# Altium schematic sheet OZ440-SE100-CAR003_sheet8.SchDoc
size A3
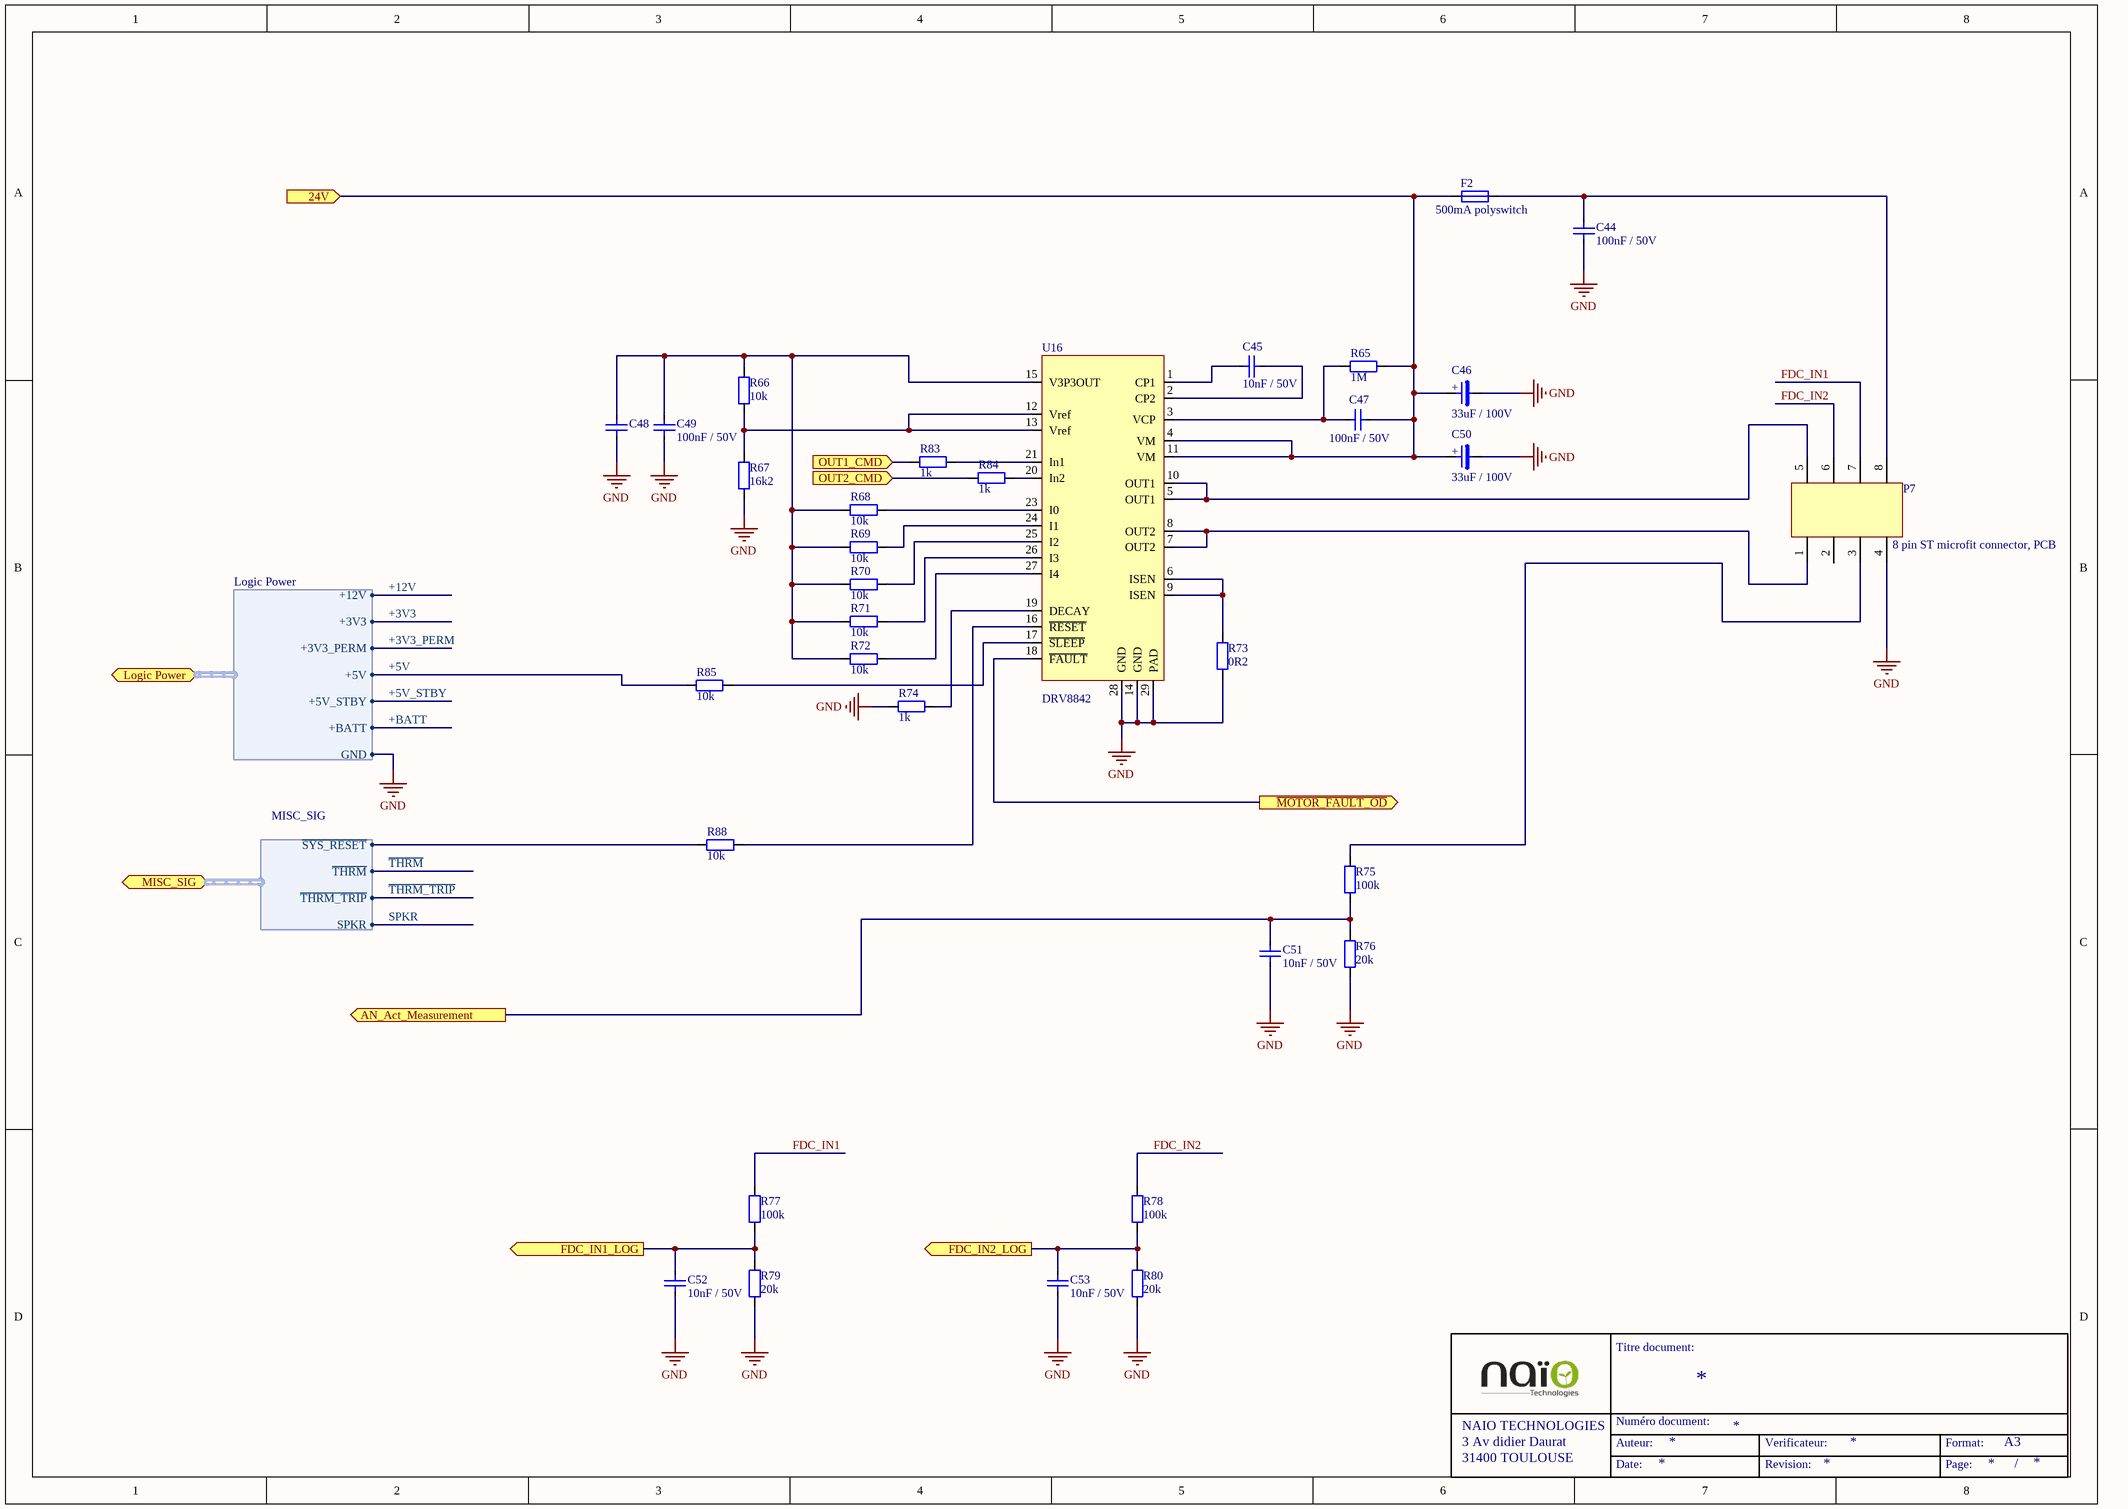
[diagram p0: OZ440-SE100-CAR003_sheet8.SchDoc]

## Parts
C44  Displayed reference: 100nF / 50V  [C0805-STD]  (hidden comment: CAP-SMD)
C45  Displayed reference: 10nF / 50V  [C0805-STD]  (hidden comment: CAP-SMD)
C46  Displayed reference: 33uF / 100V  [CAP-ELECTRO-SMD_SIZE_G]  (hidden comment: CAP-POL-SMD)
C47  Displayed reference: 100nF / 50V  [C0805-STD]  (hidden comment: CAP-SMD)
C48  CAP-SMD  [C0805-STD]  (value not drawn)
C49  Displayed reference: 100nF / 50V  [C0805-STD]  (hidden comment: CAP-SMD)
C50  Displayed reference: 33uF / 100V  [CAP-ELECTRO-SMD_SIZE_G]  (hidden comment: CAP-POL-SMD)
C51  Displayed reference: 10nF / 50V  [C0805-STD]  (hidden comment: CAP-SMD)
C52  Displayed reference: 10nF / 50V  [C0805-STD]  (hidden comment: CAP-SMD)
C53  Displayed reference: 10nF / 50V  [C0805-STD]  (hidden comment: CAP-SMD)
F2  Displayed reference: 500mA polyswitch  [R0805-STD]  (hidden comment: FUSE-SMD)
P7  Displayed reference: 8 pin ST microfit connector, PCB  [CONN-SPE_MOLEX_43045-0812]  (hidden comment: CONN-SPE-8P_MOLEX_43045-0801)
R65  Displayed reference: 1M  [R0805-STD]  (hidden comment: RES-SMD)
R66  Displayed reference: 10k  [R0805-STD]  (hidden comment: RES-SMD)
R67  Displayed reference: 16k2  [R0805-STD]  (hidden comment: RES-SMD)
R68  Displayed reference: 10k  [R0805-STD]  (hidden comment: RES-SMD)
R69  Displayed reference: 10k  [R0805-STD]  (hidden comment: RES-SMD)
R70  Displayed reference: 10k  [R0805-STD]  (hidden comment: RES-SMD)
R71  Displayed reference: 10k  [R0805-STD]  (hidden comment: RES-SMD)
R72  Displayed reference: 10k  [R0805-STD]  (hidden comment: RES-SMD)
R73  Displayed reference: 0R2  [R2512-STD]  (hidden comment: RES-SMD)
R74  Displayed reference: 1k  [R0805-STD]  (hidden comment: RES-SMD)
R75  Displayed reference: 100k  [R0805-STD]  (hidden comment: RES-SMD)
R76  Displayed reference: 20k  [R0805-STD]  (hidden comment: RES-SMD)
R77  Displayed reference: 100k  [R0805-STD]  (hidden comment: RES-SMD)
R78  Displayed reference: 100k  [R0805-STD]  (hidden comment: RES-SMD)
R79  Displayed reference: 20k  [R0805-STD]  (hidden comment: RES-SMD)
R80  Displayed reference: 20k  [R0805-STD]  (hidden comment: RES-SMD)
R83  Displayed reference: 1k  [R0805-STD]  (hidden comment: RES-SMD)
R84  Displayed reference: 1k  [R0805-STD]  (hidden comment: RES-SMD)
R85  Displayed reference: 10k  [R0805-STD]  (hidden comment: RES-SMD)
R88  Displayed reference: 10k  [R0805-STD]  (hidden comment: RES-SMD)
U16  Displayed reference: DRV8842  [TSSOP28-SPE-DRV8842]  (hidden comment: DRV8842-TSSOP28)

## Ports
24V (in), AN_Act_Measurement (out), FDC_IN1_LOG (out), FDC_IN2_LOG (out), Logic Power (harness Logic Power), MISC_SIG (harness MISC_SIG), OUT1_CMD (in), OUT2_CMD (in), ~{MOTOR_FAULT_OD} (out)

## Harnesses
MISC_SIG: ~{SYS_RESET}, ~{THRM}, ~{THRM_TRIP}, SPKR
Logic Power: +12V, +3V3, +3V3_PERM, +5V, +5V_STBY, +BATT, GND

## Nets
GND: C44.1 C46.2 C48.1 C49.1 C50.2 C51.1 C52.1 C53.1 P7.4 R67.1 R73.1 R74.1 R76.1 R79.1 R80.1 U16.14(GND) U16.28(GND) U16.29(PAD) ; port Logic Power.GND
24V: C46.1 C47.2 C50.1 F2.1 R65.2 U16.4(VM) U16.11(VM) ; port 24V
+3V3: port Logic Power.+3V3
+3V3_PERM: port Logic Power.+3V3_PERM
+5V: R85.1 ; port Logic Power.+5V
+5V_STBY: port Logic Power.+5V_STBY
+12V: port Logic Power.+12V
+BATT: port Logic Power.+BATT
~{MOTOR_FAULT_OD}: U16.18(~{FAULT}) ; port ~{MOTOR_FAULT_OD}
~{THRM}: port MISC_SIG.~{THRM}
~{THRM_TRIP}: port MISC_SIG.~{THRM_TRIP}
AN_Act_Measurement: C51.2 R75.1 R76.2 ; port AN_Act_Measurement
FDC_IN1: P7.7 R77.2
FDC_IN1_LOG: C52.2 R77.1 R79.2 ; port FDC_IN1_LOG
FDC_IN2: P7.6 R78.2
FDC_IN2_LOG: C53.2 R78.1 R80.2 ; port FDC_IN2_LOG
OUT1_CMD: R83.1 ; port OUT1_CMD
OUT2_CMD: R84.1 ; port OUT2_CMD
SPKR: port MISC_SIG.SPKR
NetC44_2: C44.2 F2.2 P7.8
NetC45_1: C45.1 U16.1(CP1)
NetC45_2: C45.2 U16.2(CP2)
NetC47_1: C47.1 R65.1 U16.3(VCP)
NetC48_2: C48.2 C49.2 R66.1 R68.1 R69.1 R70.1 R71.1 R72.1 U16.15(V3P3OUT)
NetP7_1: P7.1 U16.7(OUT2) U16.8(OUT2)
NetP7_3: P7.3 R75.2
NetP7_5: P7.5 U16.5(OUT1) U16.10(OUT1)
NetR66_2: R66.2 R67.2 U16.12(Vref) U16.13(Vref)
NetR68_2: R68.2 U16.23(I0)
NetR69_2: R69.2 U16.24(I1)
NetR70_2: R70.2 U16.25(I2)
NetR71_2: R71.2 U16.26(I3)
NetR72_2: R72.2 U16.27(I4)
NetR73_2: R73.2 U16.6(ISEN) U16.9(ISEN)
NetR74_2: R74.2 U16.19(DECAY)
NetR83_2: R83.2 U16.21(In1)
NetR84_2: R84.2 U16.20(In2)
NetR85_2: R85.2 U16.17(~{SLEEP})
NetR88_1: R88.1 ; port MISC_SIG.~{SYS_RESET}
NetR88_2: R88.2 U16.16(~{RESET})

Not connected (* = marked no-connect by the designer): P7 2

## Notes on the sheet
- Titre document:
- NAIO TECHNOLOGIES
- 3 Av didier Daurat
- 31400 TOULOUSE
- Auteur:
- Numéro document:
- Verificateur:
- Format:
- A3
- Date:
- Revision:
- Page:
- /
- (in symbol EEE2AA330P) +

## Library data of the parts
C44 C47-C49 = VJ0805Y104KXAxx: 0805 100nF / 50V  X7R ceramic capacitor; Manufacturer: vishay; Max Voltage: 50; Tolerance: +/- 10%; Validated: N; Reference: VJ0805Y104KXAxx; Value: 100nF; Material: X7R; Footprint description: standard Capacitor 0805; Pin Count: 2; helpURL: http://www.vishay.com/docs/45200/highrels.pdf; Supplier 1: Farnell; Supplier Part Number 1: 1612208; Supplier 2: Digi-Key; Supplier Part Number 2: 720-1266-6-ND
  C48: Displayed reference: 100nF / 50V
C45 C51-C53 = VJ0805Y103KXAxx: 0805 10nF / 50V X7R ceramic capacitor; Manufacturer: vishay; Max Voltage: 50; Tolerance: +/- 10%; Validated: N; Reference: VJ0805Y103KXAxx; Value: 10nF; Material: X7R; Footprint description: standard Capacitor 0805; Pin Count: 2; helpURL: http://www.vishay.com/docs/45200/highrels.pdf; Supplier 1: Farnell; Supplier Part Number 1: 1650952; Supplier 2: Digi-Key; Supplier Part Number 2: BC1293CT-ND
C46 C50 = EEE2AA330P: 33uF / 100V Aluminium capacitor SMD; Manufacturer: Panasonic; Max Current: 0.05; Reference: EEE2AA330P; Value: 33uF; Max Voltage: 100V; Material: Aluminium; Footprint description: 10mmx10mm; Pin Count: 2; helpURL: http://industrial.panasonic.com/www-data/pdf/ABA0000/ABA0000CE2.pdf; Supplier 1: Farnell; Supplier Part Number 1: 1899628; Supplier 2: Mouser; Supplier Part Number 2: 667-EEE-2AA330P
F2 = MF-PSMF050X-2: 0805 500mA resettable fuse; Manufacturer: BOURNS; Validated: False; Reference: MF-PSMF050X-2; Max Current: 500mA; Pin Count: 2; helpURL: http://www.farnell.com/datasheets/1442129.pdf; Supplier 1: Farnell; Supplier Part Number 1: 1294876; Supplier 2: Mouser; Supplier Part Number 2: 652-MF-PSMF050X-2
P7 = 43045-0812: 8 pin Microfit connector; Manufacturer: Molex; Max Voltage: 600V; Max Current: 5A; Reference: 43045-0812; Footprint description: 8 pin SMT connector ST, TH; Pin Count: 8; Rev: G; helpURL: http://www.molex.com/pdm_docs/sd/430450812_sd.pdf
R65 = CRCW08051M00FKxx: 1Mohm 1% 0805 SMD resistor; Manufacturer: Vishay; Value: 1000000; Rated Power: 0.125W; Validated: False; Reference: CRCW08051M00FKxx; Tolerance: 1%; Footprint description: standard 0805 SMD; Pin Count: 2; helpURL: http://www.vishay.com/docs/20035/dcrcwe3.pdf; Supplier 1: Farnell; Supplier Part Number 1: 2413580; Supplier 2: Mouser; Supplier Part Number 2: 71-CRCW08051M00FKEB
R66 R68-R72 R85 R88 = CRCW080510K0FKxx: 10k Ohm 0805 SMD resistor; Manufacturer: Vishay; Value: 10 000; Tolerance: 1 %; Rated Power: 0,125 W; Validated: No; Reference: CRCW080510K0FKxx; Footprint description: standard 0805 SMD; Pin Count: 2; helpURL: http://www.vishay.com/docs/20035/dcrcwe3.pdf; Supplier 1: Farnell; Supplier Part Number 1: 1469856; Supplier 2: Mouser; Supplier Part Number 2: 71-CRCW0805-10K-E3
R67 = CRCW080516K2FKxx: 16k2 Ohm 0805 SMD resistor; Manufacturer: Vishay; Value: 16200; Tolerance: 1%; Rated Power: 0.125W; Validated: No; Reference: CRCW080516K2FKxx; Footprint description: standard 0805 SMD; Pin Count: 2; helpURL: http://www.vishay.com/docs/20035/dcrcwe3.pdf; Supplier 1: Mouser; Supplier Part Number 1: 71-CRCW0805-16.2K-E3; Supplier 2: Farnell; Supplier Part Number 2: 1469878
R73 = CRM2512-JX-R200ELF: 0.2R 1% 2512 SMD resistor; Manufacturer: Bourns; Value: 0.2; Rated Power: 2W; Validated: False; Reference: CRM2512-JX-R200ELF; Tolerance: 1%; Footprint description: standard 2512 SMD; Pin Count: 2; helpURL: http://www.mouser.com/ds/2/54/CRM-335960.pdf; Supplier 1: Farnell; Supplier Part Number 1: 2328177; Supplier 2: Mouser; Supplier Part Number 2: 652-CRM2512JXR200ELF
R74 R83 R84 = CRCW08051K00FKxx: 1k Ohm 0805 SMD resistor; Manufacturer: Vishay; Value: 1 000; Tolerance: 1 %; Rated Power: 0,125 W; Validated: No; Reference: CRCW08051K00FKxx; Footprint description: standard 0805 SMD; Pin Count: 2; helpURL: http://www.vishay.com/docs/20035/dcrcwe3.pdf; Supplier 1: Farnell; Supplier Part Number 1: 1469847; Supplier 2: Mouser; Supplier Part Number 2: 71-CRCW0805-1.0K-E3
R75 R77 R78 = CRCW0805100KFKxx: 100k Ohm 0805 SMD resistor; Manufacturer: Vishay; Value: 100 000; Tolerance: 1 %; Rated Power: 0,125 W; Validated: No; Reference: CRCW0805100KFKxx; Footprint description: standard 0805 SMD; Pin Count: 2; helpURL: http://www.vishay.com/docs/20035/dcrcwe3.pdf; Supplier 1: Farnell; Supplier Part Number 1: 1469860; Supplier 2: Mouser; Supplier Part Number 2: 71-CRCW0805-100K-E3
R76 R79 R80 = CRCW080520K0FKxx: 20k Ohm 0805 SMD resistor; Manufacturer: Vishay; Value: 20 000; Tolerance: 1 %; Rated Power: 0,125 W; Validated: No; Reference: CRCW080520K0FKxx; Footprint description: standard 0805 SMD; Pin Count: 2; helpURL: http://www.vishay.com/docs/20035/dcrcwe3.pdf; Supplier 1: Farnell; Supplier Part Number 1: 1469893; Supplier 2: Mouser; Supplier Part Number 2: 71-CRCW0805-20K-E3
U16 = DRV8842PWPR: DC MOTOR DRIVER IC; Manufacturer: TI; Max Voltage: 45V; Max Current: 5A; Reference: DRV8842PWPR; Footprint description: TSSOP28 with thermal pad; Pin Count: 28; Rev: 08/2013; helpURL: http://www.ti.com/lit/ds/symlink/drv8842.pdf; Supplier 1: Mouser; Supplier Part Number 1: 595-DRV8842PWP; Supplier 2: Farnell; Supplier Part Number 2: 1903645